# EAGLE design M2S-v2-Modular (EAGLE 9.6.2)
DESIGNER: Mark Aldritz Dela Virgen; REV: A
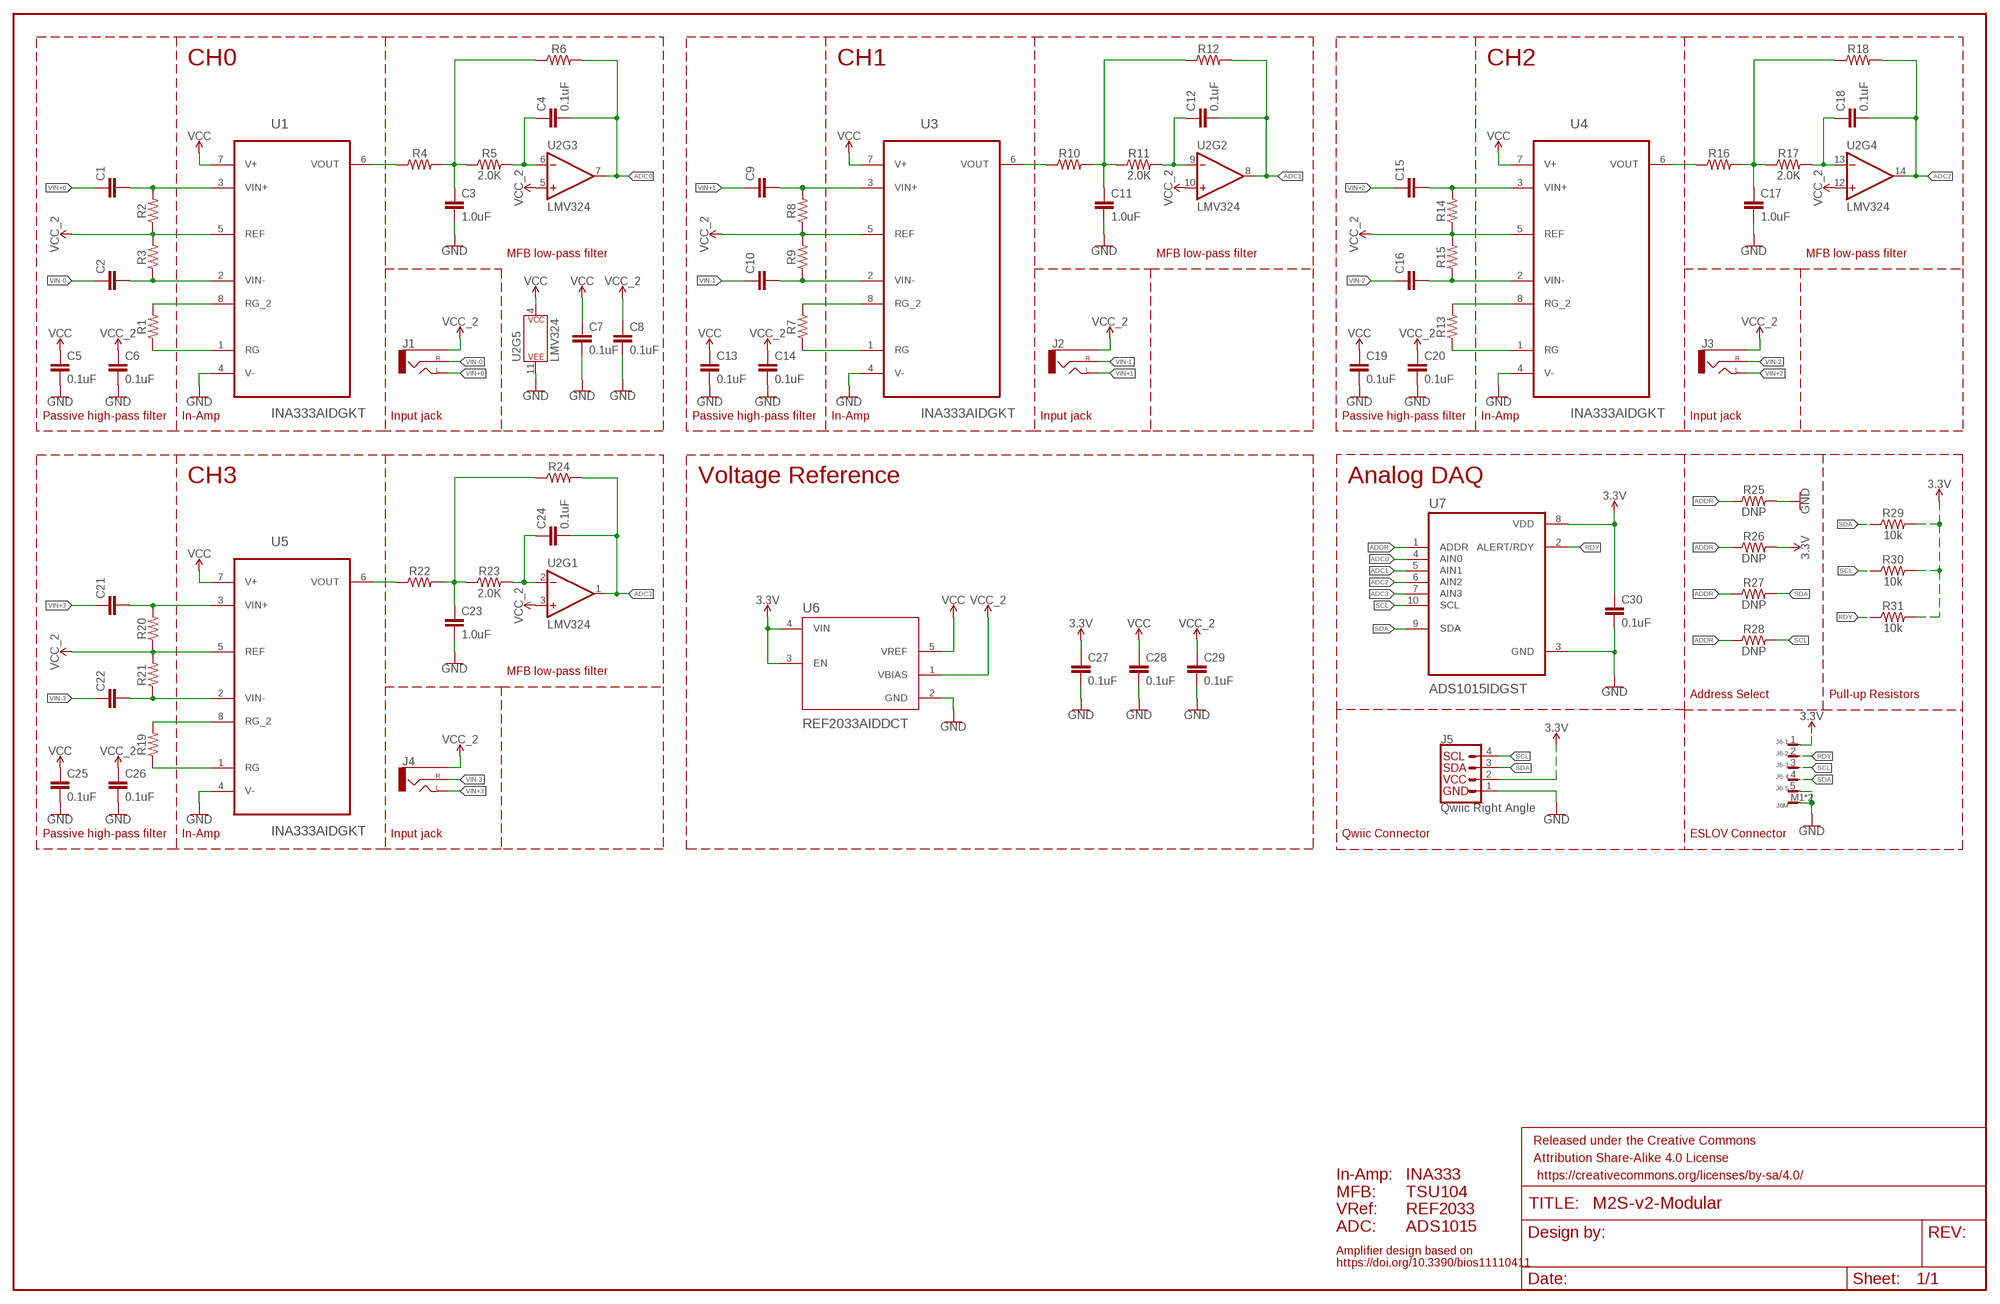
[diagram p0: schematic, sheet 1]

## Parts
C1  0.22uF  CAP-0402  [0402]
C2  0.22uF  CAP-0402  [0402]
C3  1.0uF  1.0UF-0402-16V-10%  [0402]
C4  0.1uF  0.1UF-0402-6.3V-10%-X7R  [0402]
C5  0.1uF  0.1UF-0402-6.3V-10%-X7R  [0402]
C6  0.1uF  0.1UF-0402-6.3V-10%-X7R  [0402]
C7  0.1uF  0.1UF-0402-6.3V-10%-X7R  [0402]
C8  0.1uF  0.1UF-0402-6.3V-10%-X7R  [0402]
C9  0.22uF  CAP-0402  [0402]
C10  0.22uF  CAP-0402  [0402]
C11  1.0uF  1.0UF-0402-16V-10%  [0402]
C12  0.1uF  0.1UF-0402-6.3V-10%-X7R  [0402]
C13  0.1uF  0.1UF-0402-6.3V-10%-X7R  [0402]
C14  0.1uF  0.1UF-0402-6.3V-10%-X7R  [0402]
C15  0.22uF  CAP-0402  [0402]
C16  0.22uF  CAP-0402  [0402]
C17  1.0uF  1.0UF-0402-16V-10%  [0402]
C18  0.1uF  0.1UF-0402-6.3V-10%-X7R  [0402]
C19  0.1uF  0.1UF-0402-6.3V-10%-X7R  [0402]
C20  0.1uF  0.1UF-0402-6.3V-10%-X7R  [0402]
C21  0.22uF  CAP-0402  [0402]
C22  0.22uF  CAP-0402  [0402]
C23  1.0uF  1.0UF-0402-16V-10%  [0402]
C24  0.1uF  0.1UF-0402-6.3V-10%-X7R  [0402]
C25  0.1uF  0.1UF-0402-6.3V-10%-X7R  [0402]
C26  0.1uF  0.1UF-0402-6.3V-10%-X7R  [0402]
C27  0.1uF  0.1UF-0402-6.3V-10%-X7R  [0402]
C28  0.1uF  0.1UF-0402-6.3V-10%-X7R  [0402]
C29  0.1uF  0.1UF-0402-6.3V-10%-X7R  [0402]
C30  0.1uF  0.1UF-0402-6.3V-10%-X7R  [0402]
FRAME1  FRAME-LEDGERNO_FOOTPRINT  [DUMMY]
J1  AUDIO_JACK_2.5MM_2.5MM  [STEREOJACK2.5MM_STEREOJACK2.5MM]
J2  AUDIO_JACK_2.5MM_2.5MM  [STEREOJACK2.5MM_STEREOJACK2.5MM]
J3  AUDIO_JACK_2.5MM_2.5MM  [STEREOJACK2.5MM_STEREOJACK2.5MM]
J4  AUDIO_JACK_2.5MM_2.5MM  [STEREOJACK2.5MM_STEREOJACK2.5MM]
J5  Qwiic Right Angle  I2C_STANDARDQWIIC  [JST04_1MM_RA]
J6  SM05B-SRSS-TB  [SM05B-SRSS-TB]
R1  1KOHM-0402-1/16W-1%  [0402]
R2  RESISTOR0402  [0402]
R3  RESISTOR0402  [0402]
R4  RESISTOR0402  [0402]
R5  2.0K  2.0KOHM-0402-1/16W-1%  [0402]
R6  RESISTOR0402  [0402]
R7  1KOHM-0402-1/16W-1%  [0402]
R8  RESISTOR0402  [0402]
R9  RESISTOR0402  [0402]
R10  RESISTOR0402  [0402]
R11  2.0K  2.0KOHM-0402-1/16W-1%  [0402]
R12  RESISTOR0402  [0402]
R13  1KOHM-0402-1/16W-1%  [0402]
R14  RESISTOR0402  [0402]
R15  RESISTOR0402  [0402]
R16  RESISTOR0402  [0402]
R17  2.0K  2.0KOHM-0402-1/16W-1%  [0402]
R18  RESISTOR0402  [0402]
R19  1KOHM-0402-1/16W-1%  [0402]
R20  RESISTOR0402  [0402]
R21  RESISTOR0402  [0402]
R22  RESISTOR0402  [0402]
R23  2.0K  2.0KOHM-0402-1/16W-1%  [0402]
R24  RESISTOR0402  [0402]
R25  DNP  DNP-0402  [0402]
R26  DNP  DNP-0402  [0402]
R27  DNP  DNP-0402  [0402]
R28  DNP  DNP-0402  [0402]
R29  10k  10KOHM-0402-1/16W-1%  [0402]
R30  10k  10KOHM-0402-1/16W-1%  [0402]
R31  10k  10KOHM-0402-1/16W-1%  [0402]
U1  INA333AIDGKT  [SOP65P490X110-8N]
U2  LMV324  [SO14]
U3  INA333AIDGKT  [SOP65P490X110-8N]
U4  INA333AIDGKT  [SOP65P490X110-8N]
U5  INA333AIDGKT  [SOP65P490X110-8N]
U6  REF2033AIDDCT  [SOT95P280X110-5N]
U7  ADS1015IDGST  [SOP50P490X110-10N]

## Nets
3.3V: C27.1 C30.1 J5.2 J6.1 R26.2 R29.2 R30.2 R31.2 U6.3(EN) U6.4(VIN) U7.8(VDD)
ADC0: C4.2 R6.2 U2.7(OUT) U7.4(AIN0)
ADC1: C12.2 R12.2 U2.8(OUT) U7.5(AIN1)
ADC2: C18.2 R18.2 U2.14(OUT) U7.6(AIN2)
ADC3: C24.2 R24.2 U2.1(OUT) U7.7(AIN3)
ADDR: R25.1 R26.1 R27.1 R28.1 U7.1(ADDR)
GND: C3.2 C5.2 C6.2 C7.2 C8.2 C11.2 C13.2 C14.2 C17.2 C19.2 C20.2 C23.2 C25.2 C26.2 C27.2 C28.2 C29.2 C30.2 J5.1 J6.5 J6.M1 J6.M2 R25.2 U1.4(V-) U2.11(P$V-) U3.4(V-) U4.4(V-) U5.4(V-) U6.2(GND) U7.3(GND)
N$1: R1.2 U1.8(RG_2)
N$2: R1.1 U1.1(RG)
N$3: C1.2 R2.2 U1.3(VIN+)
N$4: C2.2 R3.1 U1.2(VIN-)
N$5: R4.1 U1.6(VOUT)
N$6: C3.1 R4.2 R5.1 R6.1
N$7: C4.1 R5.2 U2.6(-IN)
N$8: R7.2 U3.8(RG_2)
N$9: R7.1 U3.1(RG)
N$10: C9.2 R8.2 U3.3(VIN+)
N$11: C10.2 R9.1 U3.2(VIN-)
N$12: R10.1 U3.6(VOUT)
N$13: C11.1 R10.2 R11.1 R12.1
N$14: C12.1 R11.2 U2.9(-IN)
N$15: R13.2 U4.8(RG_2)
N$16: R13.1 U4.1(RG)
N$17: C15.2 R14.2 U4.3(VIN+)
N$18: C16.2 R15.1 U4.2(VIN-)
N$19: R16.1 U4.6(VOUT)
N$20: C17.1 R16.2 R17.1 R18.1
N$21: C18.1 R17.2 U2.13(-IN)
N$22: R19.2 U5.8(RG_2)
N$23: R19.1 U5.1(RG)
N$24: C21.2 R20.2 U5.3(VIN+)
N$25: C22.2 R21.1 U5.2(VIN-)
N$26: R22.1 U5.6(VOUT)
N$27: C23.1 R22.2 R23.1 R24.1
N$28: C24.1 R23.2 U2.2(-IN)
RDY: J6.2 R31.1 U7.2(ALERT/RDY)
SCL: J5.4 J6.3 R28.2 R30.1 U7.10(SCL)
SDA: J5.3 J6.4 R27.2 R29.1 U7.9(SDA)
VCC: C5.1 C7.1 C13.1 C19.1 C25.1 C28.1 U1.7(V+) U2.4(P$V+) U3.7(V+) U4.7(V+) U5.7(V+) U6.5(VREF)
VCC_2: C6.1 C8.1 C14.1 C20.1 C26.1 C29.1 J1.RING1(SLEEVE) J2.RING1(SLEEVE) J3.RING1(SLEEVE) J4.RING1(SLEEVE) R2.1 R3.2 R8.1 R9.2 R14.1 R15.2 R20.1 R21.2 U1.5(REF) U2.3(+IN) U2.5(+IN) U2.10(+IN) U2.12(+IN) U3.5(REF) U4.5(REF) U5.5(REF) U6.1(VBIAS)
VIN+0: C1.1 J1.SHIELD(LEFT)
VIN+1: C9.1 J2.SHIELD(LEFT)
VIN+2: C15.1 J3.SHIELD(LEFT)
VIN+3: C21.1 J4.SHIELD(LEFT)
VIN-0: C2.1 J1.TIP(RIGHT)
VIN-1: C10.1 J2.TIP(RIGHT)
VIN-2: C16.1 J3.TIP(RIGHT)
VIN-3: C22.1 J4.TIP(RIGHT)

## Notes on the sheet
- CH0 | CH1 | CH2
- MFB low-pass filter | MFB low-pass filter | MFB low-pass filter
- Passive high-pass filter | In-Amp | Input jack | Passive high-pass filter | In-Amp | Input jack | Passive high-pass filter | In-Amp | Input jack
- CH3 | Voltage Reference | Analog DAQ
- MFB low-pass filter
- Address Select | Pull-up Resistors
- Passive high-pass filter | In-Amp | Input jack | Qwiic Connector | ESLOV Connector
- In-Amp:
  MFB:
  VRef:
  ADC:
- INA333
  TSU104
  REF2033
  ADS1015
- Amplifier design based on 
  https://doi.org/10.3390/bios11110411

## Library data of the parts
C1 C2 C9 C10 C15 C16 C21 C22 = SparkFun-Capacitors:CAP
C3 C11 C17 C23 = SparkFun-Capacitors:1.0UF: 1µF ceramic capacitors A capacitor is a passive two-terminal electrical component used to store electrical energy temporarily in an electric field.; PROD_ID: CAP-12417
C4-C8 C12-C14 C18-C20 C24-C30 = SparkFun-Capacitors:0.1UF: 0.1µF ceramic capacitors A capacitor is a passive two-terminal electrical component used to store electrical energy temporarily in an electric field.; PROD_ID: CAP-14993
FRAME1 = SparkFun-Aesthetics:FRAME-LEDGER: Schematic Frame - Ledger Standard 11x14 US Ledger frame
J1-J4 = SparkFun-Connectors:AUDIO_JACK_2.5MM: Audio Jack 2.5mm variants of PTH and SMT audio jacks. SparkFun Products: SparkFun PicoBoard <https://www.sparkfun.com/products/11888>- 2.5mm SMD; PROD_ID: CONN-09878
J5 = SparkFun-Connectors:I2C_STANDARD: SparkFun I2C Standard Pinout Header SparkFun has standardized on a pinout for all I2C based sensor breakouts. This pinout allows I2C boards to be plugged directly into the headers on Arduino Uno compatible boards, and to be daisy chained easily. Example SparkFun Products: SparkFun Atmospheric Sensor Breakout - BME280 <https://www.sparkfun.com/products/13676> SparkFun Altitude/Pressure Sensor Breakout - MPL3115A2 <https://www.sparkfun.com/products/11084> SparkFun TOF Range Finder Sensor - VL6180 <https://www.sparkfun.com/products/12785>; PROD_ID: CONN-13694
J6 = con-JST-SH:SM05B-SRSS-TB
R1 R7 R13 R19 = SparkFun-Resistors:1KOHM: 1kΩ resistor A resistor is a passive two-terminal electrical component that implements electrical resistance as a circuit element. Resistors act to reduce current flow, and, at the same time, act to lower voltage levels within circuits. - Wikipedia; PROD_ID: RES-14342
R2-R4 R6 R8-R10 R12 R14-R16 R18 R20-R22 R24 = SparkFun-Resistors:RESISTOR: Generic Resistor Package
R5 R11 R17 R23 = SparkFun-Resistors:2.0KOHM: 2kΩ resistor A resistor is a passive two-terminal electrical component that implements electrical resistance as a circuit element. Resistors act to reduce current flow, and, at the same time, act to lower voltage levels within circuits. - Wikipedia; PROD_ID: RES-15406
R25-R28 = SparkFun-Resistors:DNP: Do-Not-Populate resistor A resistor is a passive two-terminal electrical component that implements electrical resistance as a circuit element. Resistors act to reduce current flow, and, at the same time, act to lower voltage levels within circuits. - Wikipedia
R29-R31 = SparkFun-Resistors:10KOHM: 10kΩ resistor A resistor is a passive two-terminal electrical component that implements electrical resistance as a circuit element. Resistors act to reduce current flow, and, at the same time, act to lower voltage levels within circuits. - Wikipedia; PROD_ID: RES-14241
U1 U3-U5 = INA333AIDGKT:INA333AIDGKT
U2 = SparkFun-IC-Amplifiers:LMV324: IC LMV324 Quad Op Amp Jellybean quad op-amp Datasheet <http://cdn.sparkfun.com/datasheets/Sensors/Sound/LMV324.pdf> SparkFun Products SparkFun Sensor Kit <https://www.sparkfun.com/products/13754> (DEV-13754) SparkFun Inventor's Kit for Arduino 101 <https://www.sparkfun.com/products/13844> (KIT-13844) SparkFun Sound Detector <https://www.sparkfun.com/products/12642> (SEN-12642); PROD_ID: IC-08227
U6 = REF2033AIDDCT:REF2033AIDDCT: Check availability <https://pricing.snapeda.com/parts/REF2033AIDDCT/Texas%20Instruments/view-part?ref=eda>; AVAILABILITY: In Stock; CHECK_PRICES: https://www.snapeda.com/parts/REF2033AIDDCT/Texas+Instruments/view-part/?ref=eda; DESCRIPTION: 3.3-V Vref, low-drift, low-power, dual-output Vref & Vref/2 voltage reference; MF: Texas Instruments; MP: REF2033AIDDCT; PACKAGE: SOT-23-THN-5 Texas Instruments; PRICE: None; SNAPEDA_LINK: https://www.snapeda.com/parts/REF2033AIDDCT/Texas+Instruments/view-part/?ref=snap
U7 = ADS1015IDGST:ADS1015IDGST: Check availability <https://pricing.snapeda.com/parts/ADS1015IDGST/Texas%20Instruments/view-part?ref=eda>; AVAILABILITY: In Stock; CHECK_PRICES: https://www.snapeda.com/parts/ADS1015IDGST/Texas+Instruments/view-part/?ref=eda; DESCRIPTION: 12-bit, 3.3-kSPS, 4-channel, delta-sigma ADC with PGA, oscillator, VREF, comparator and I2C; MF: Texas Instruments; MP: ADS1015IDGST; PACKAGE: VSSOP-10 Texas Instruments; PRICE: None; SNAPEDA_LINK: https://www.snapeda.com/parts/ADS1015IDGST/Texas+Instruments/view-part/?ref=snap

## Board
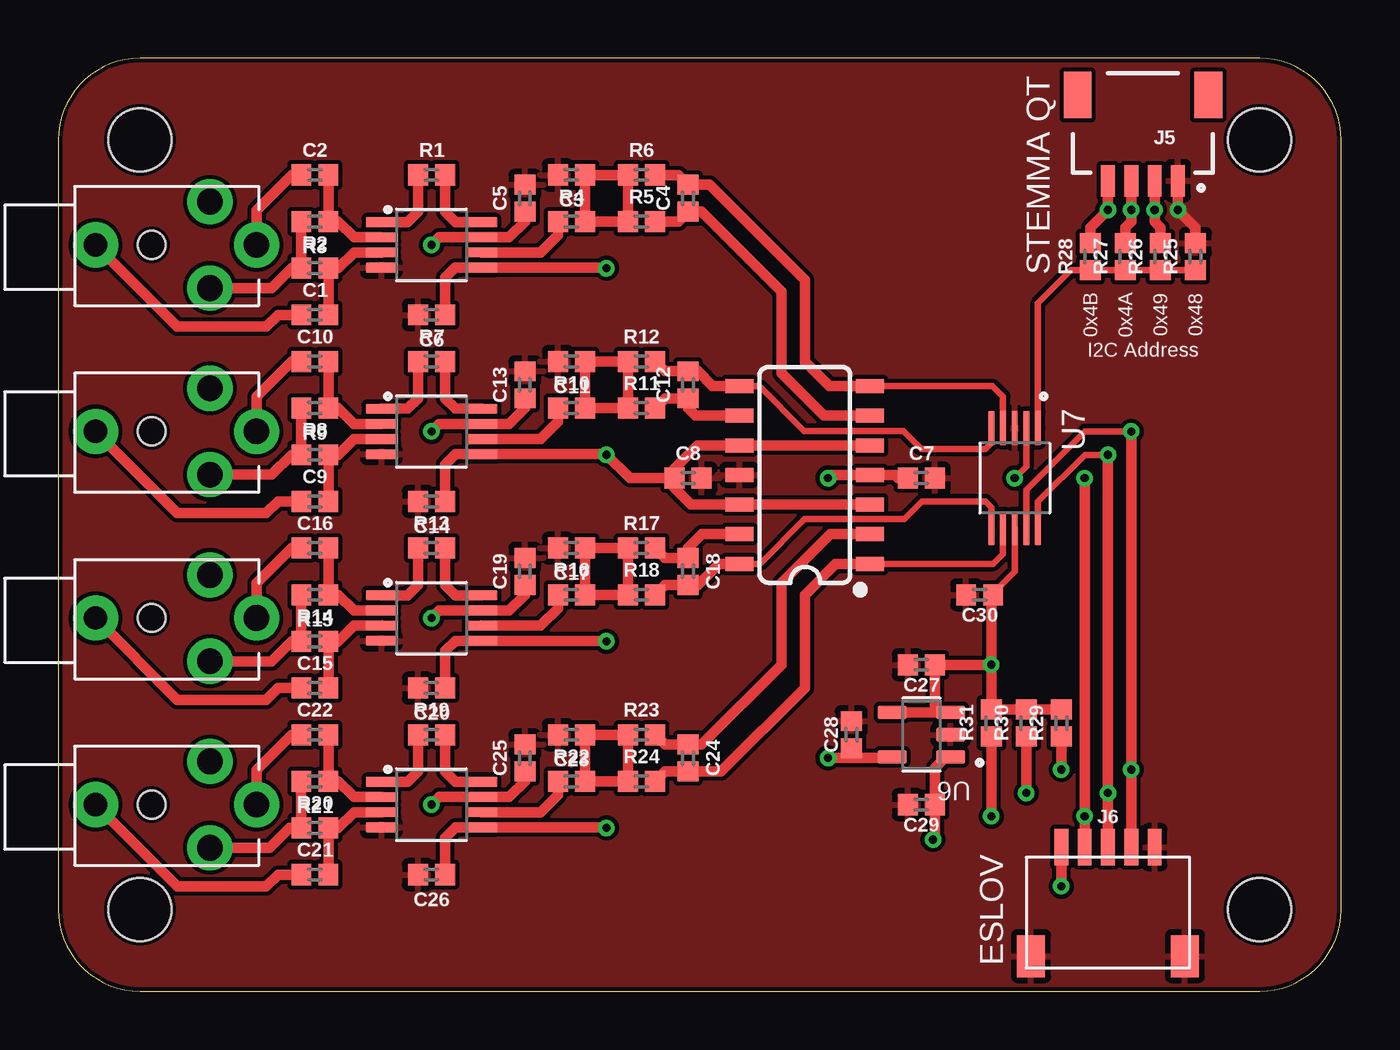
[diagram p1: board, top side]
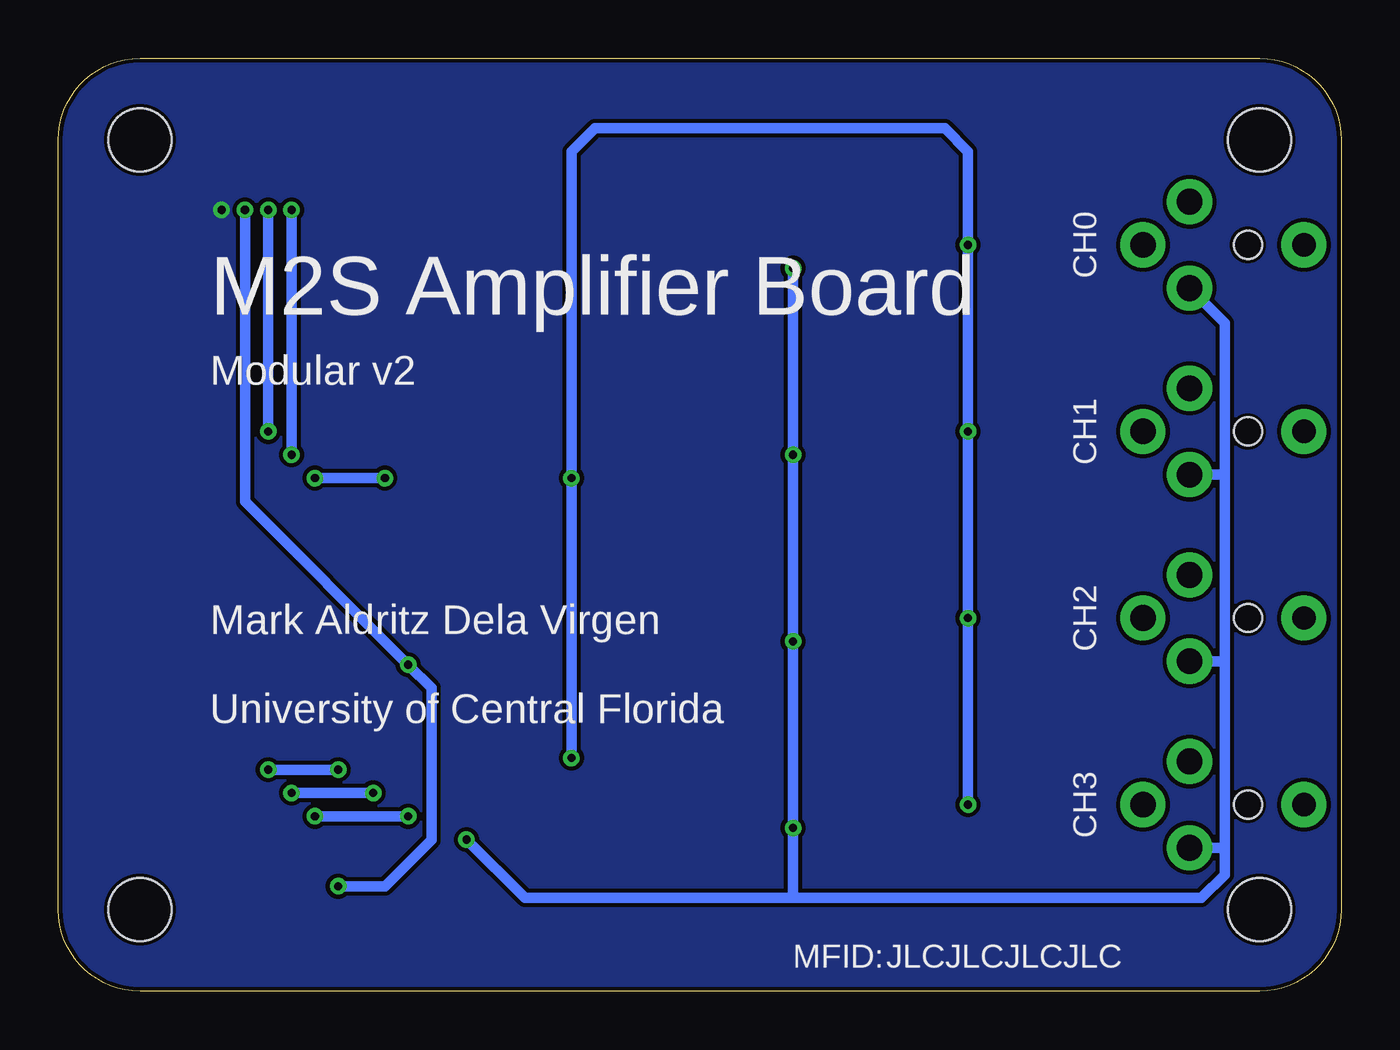
[diagram p2: board, bottom side, seen from below]

Size 55 x 40 mm. Coordinates in mm from the lower left corner, seen from the top.
Outline: 51.5,40 3.5,40 arc90 0,36.5 0,3.5 arc90 3.5,0 51.5,0 arc90 55,3.5 55,36.5 arc90 51.5,40
Copper layers (1*16): Top 0.035mm / dielectric 1.5mm / Bottom 0.035mm
Design rules "SparkFun-2-Layer-General-JLCPCB": minimum track width 7mil, minimum drill 0.3mm, track to track 7mil, track to pad 7mil, pad to pad 7mil, via to via 7mil, smd to smd 7mil, copper to edge 7mil, drill to drill 7mil, minimum pad ring 7mil, minimum via ring 7mil, stop-mask expansion 3mil, vias tented up to drill 25mil, thermal gap 10mil
Holes 2.7 mm at 3.5,3.5 51.5,3.5 51.5,36.5 3.5,36.5

### Footprints (pad centres in the part's own frame; a part is rotated, then mirrored left to right if it is on the bottom)
0402 = smd 0.85 x 0.9: 1 -0.58,0; 2 0.58,0
STEREOJACK2.5MM_STEREOJACK2.5MM = drill 1.1 pad 1.93: RING1 2.5,-1.85; RING2 2.5,1.85; TIP 4.5,0 | drill 1 pad 1.93: SHIELD -2.4,0 | hole 1.2: 0,0
JST04_1MM_RA = smd 0.6 x 1.35: 1 -1.5,0; 2 -0.5,0; 3 0.5,0; 4 1.5,0 | smd 1.2 x 2: NC1 2.8,-3.675; NC2 -2.8,-3.675
SM05B-SRSS-TB = smd 0.6 x 1.55: 1 -2,4.675; 2 -1,4.675; 3 0,4.675; 4 1,4.675; 5 2,4.675 | smd 1.2 x 1.8: M1 3.3,0; M2 -3.3,0
SOP65P490X110-8N = smd 1.34 x 0.44: 1 -2.15,0.975; 2 -2.15,0.325; 3 -2.15,-0.325; 4 -2.15,-0.975; 5 2.15,-0.975; 6 2.15,-0.325; 7 2.15,0.325; 8 2.15,0.975
SO14 = smd 0.6 x 1.2: 1 -3.175,-2.8; 2 -1.905,-2.8; 3 -0.635,-2.8; 4 0.635,-2.8; 5 1.905,-2.8; 6 3.175,-2.8; 7 4.445,-2.8; 8 4.445,2.8; 9 3.175,2.8; 10 1.905,2.8; 11 0.635,2.8; 12 -0.635,2.8; 13 -1.905,2.8; 14 -3.175,2.8
SOT95P280X110-5N = smd 1.25 x 0.59: 1 -1.255,0.95; 2 -1.255,0; 3 -1.255,-0.95; 4 1.255,-0.95; 5 1.255,0.95
SOP50P490X110-10N = smd 1.47 x 0.28: 1 -2.15,1; 2 -2.15,0.5; 3 -2.15,0; 4 -2.15,-0.5; 5 -2.15,-1; 6 2.15,-1; 7 2.15,-0.5; 8 2.15,0; 9 2.15,0.5; 10 2.15,1

### Placement (x,y rotation side)
C1  11,29 0 top
C2  11,35 0 top
C3  22,35 180 top
C4  27,34 90 top
C5  20,34 90 top
C6  16,29 180 top
C7  37,22 0 top
C8  27,22 0 top
C9  11,21 0 top
C10  11,27 0 top
C11  22,27 180 top
C12  27,26 90 top
C13  20,26 90 top
C14  16,21 180 top
C15  11,13 0 top
C16  11,19 0 top
C17  22,19 180 top
C18  27,18 270 top
C19  20,18 90 top
C20  16,13 180 top
C21  11,5 0 top
C22  11,11 0 top
C23  22,11 180 top
C24  27,10 270 top
C25  20,10 90 top
C26  16,5 180 top
C27  37,14 180 top
C28  34,11 90 top
C29  37,8 180 top
C30  39.5,17 180 top
FRAME1  0,0 0 top
J1  4,32 0 top
J2  4,24 0 top
J3  4,16 0 top
J4  4,8 0 top
J5  46.5,34.75 180 top
J6  45,1.5 0 top
R1  16,35 0 top
R2  11,31 0 top
R3  11,33 180 top
R4  22,33 0 top
R5  25,33 0 top
R6  25,35 0 top
R7  16,27 0 top
R8  11,23 0 top
R9  11,25 180 top
R10  22,25 0 top
R11  25,25 0 top
R12  25,27 0 top
R13  16,19 0 top
R14  11,15 0 top
R15  11,17 180 top
R16  22,17 0 top
R17  25,19 0 top
R18  25,17 0 top
R19  16,11 0 top
R20  11,7 0 top
R21  11,9 180 top
R22  22,9 0 top
R23  25,11 0 top
R24  25,9 0 top
R25  48.75,31.5 90 top
R26  47.25,31.5 90 top
R27  45.75,31.5 90 top
R28  44.25,31.5 90 top
R29  43,11.5 90 top
R30  41.5,11.5 90 top
R31  40,11.5 90 top
U1  16,32 0 top
U2  32,21.5 90 top
U3  16,24 0 top
U4  16,16 0 top
U5  16,8 0 top
U6  37,11 180 top
U7  41,22 270 top

### Tracks (layer width: path | path; a pad name or v marks a point on that pad's centre or on a via)
3.3V  (via drill 0.35)
  Top 0.28: C30.1 40,17 41,18 U7.8
  Top 0.44: 37.58,11.95 U6.3 | 37.58,11.95 C27.1 v40,14 | U6.4 37.58,11.95 | R26.2 47.25,32.75 47,33 v47,33.5 J5.2 | 40,17 v40,14 | v40,14 R31.2 R30.2 R29.2 | J6.1 v43,4.5
  Bottom 0.44: v47,33.5 47,21 v40,14 39,13 39,6.5 41,4.5 v43,4.5
ADC0
  Top 0.28: U2.7 40.05,25.95 40.5,25.5 U7.4
  Top 0.44: R6.2 26.58,35 C4.2 27.92,34.58 32,30.5 32,27 33.05,25.95 U2.7
ADC1
  Top 0.28: U2.8 30.05,25.95 31.98,24.02 36.23,24.02 37,23.25 39.75,23.25 40,23.5 U7.5
  Top 0.44: R12.2 26,26.58 C12.2 27.42,26.58 28.05,25.95 U2.8
ADC2
  Top 0.28: U2.14 30.07,18.32 32,20.25 36.28,20.25 37.03,21 39.75,21 40,20.75 U7.6
  Top 0.44: R18.2 26,17.42 C18.2 27.42,17.42 28.32,18.32 U2.14
ADC3
  Top 0.28: U2.1 40.08,18.32 40.5,18.75 U7.7
  Top 0.44: R24.2 26,9.42 C24.2 28.42,9.42 32,13 32,17 33.33,18.32 U2.1
ADDR
  Top 0.28: R25.1 R26.1 R27.1 R28.1 43.42,30.92 42,29.5 U7.1
GND  (via drill 0.35)
  Top 0.44: R25.2 48.75,32.75 v48,33.5 J5.1
  pour Top: -1,-1 57,-1 57,42 -1,42
  pour Bottom: -2,-2 56,-2 56,41 -2,41
N$1
  Top 0.44: U1.8 17.02,32.98 16.58,33.42 R1.2
N$2
  Top 0.44: U1.1 14.97,32.98 15.42,33.42 R1.1
N$3
  Top 0.44: C1.2 R2.2 12,31 12.68,31.68 U1.3
N$4
  Top 0.44: C2.2 R3.1 12,33 12.68,32.33 U1.2
N$5
  Top 0.44: U1.6 20.68,31.68 21.42,32.42 R4.1
N$6
  Top 0.44: R4.2 C3.1 R6.1 R5.1 R4.2
N$7
  Top 0.44: R5.2 26.58,33 C4.1 27.58,33.42 31,30 31,26.5 32.83,24.68 U2.6
N$8
  Top 0.44: U3.8 17.02,24.98 16.58,25.42 R7.2
N$9
  Top 0.44: U3.1 14.97,24.98 15.42,25.42 R7.1
N$10
  Top 0.44: C9.2 R8.2 12,23 12.68,23.68 U3.3
N$11
  Top 0.44: C10.2 R9.1 12,25 12.68,24.32 U3.2
N$12
  Top 0.44: U3.6 20.68,23.68 21.42,24.42 R10.1
N$13
  Top 0.44: C11.1 R12.1 R11.1 R10.2 C11.1
N$14
  Top 0.44: R11.2 26,25.42 C12.1 27,25 27.32,24.68 U2.9
N$15
  Top 0.44: U4.8 17.02,16.98 16.58,17.42 R13.2
N$16
  Top 0.44: U4.1 14.97,16.98 15.42,17.42 R13.1
N$17
  Top 0.44: C15.2 R14.2 12,15 12.68,15.68 U4.3
N$18
  Top 0.44: C16.2 R15.1 12,17 12.68,16.32 U4.2
N$19
  Top 0.44: U4.6 20.68,15.68 21.42,16.42 R16.1
N$20
  Top 0.44: C17.1 R17.1 R18.1 R16.2 C17.1
N$21
  Top 0.44: R17.2 26,18.58 C18.1 27,19 27.59,19.59 U2.13
N$22
  Top 0.44: U5.8 17.02,8.97 16.58,9.42 R19.2
N$23
  Top 0.44: U5.1 14.97,8.97 15.42,9.42 R19.1
N$24
  Top 0.44: C21.2 R20.2 12,7 12.68,7.67 U5.3
N$25
  Top 0.44: C22.2 R21.1 12,9 12.68,8.32 U5.2
N$26
  Top 0.44: U5.6 20.68,7.67 21.42,8.42 R22.1
N$27
  Top 0.44: C23.1 R23.1 R24.1 R22.2 C23.1
N$28
  Top 0.44: R23.2 26,10.58 C24.1 27.58,10.58 31,14 31,17.5 33.09,19.59 U2.2
RDY  (via drill 0.35)
  Top 0.28: v41,22 41.5,22.5 U7.2
  Top 0.44: v40,7.5 R31.1 | v44,22 v44,7.5 J6.2
  Bottom 0.44: v41,22 v44,22 | v44,7.5 v40,7.5
SCL  (via drill 0.35)
  Top 0.28: v45,23 44,23 42,21 U7.10
  Top 0.44: R28.2 44.25,32.75 v45,33.5 J5.4 | v41.5,8.5 R30.1 | J6.3 v45,8.5 v45,23
  Bottom 0.44: v45,33.5 v45,23 | v45,8.5 v41.5,8.5
SDA  (via drill 0.35)
  Top 0.28: v46,24 44,24 41.5,21.5 U7.9
  Top 0.44: R27.2 45.75,32.75 46,33 v46,33.5 J5.3 | R29.1 v43,9.5 | v46,24 v46,9.5 J6.4
  Bottom 0.44: v46,33.5 v46,24 | v43,9.5 v46,9.5
VCC  (via drill 0.35)
  Top 0.44: C5.1 20,33 19.32,32.33 U1.7 16.32,32.33 v16,32 | C13.1 20,25 19.32,24.32 U3.7 16.32,24.32 v16,24 | C19.1 20,17 19.32,16.32 U4.7 16.32,16.32 v16,16 | C25.1 20,9 19.32,8.32 U5.7 16.32,8.32 v16,8 | C7.1 36,22 35.87,22.14 U2.4 33.13,22.14 v33,22 | C28.1 34,10 | 34,10 35.7,10 U6.5 | 34,10 v33,10
  Bottom 0.44: v33,10 v33,22 33,36 32,37 17,37 16,36 v16,32 v16,24 v16,16 v16,8
VCC_2  (via drill 0.35)
  Top 0.44: J4.RING1 9.07,6.15 9.92,7 R20.1 R21.2 | J3.RING1 9.15,14.15 10,15 R14.1 R15.2 | J2.RING1 9.15,22.15 10,23 R8.1 R9.2 | J1.RING1 9.15,30.15 10,31 R2.1 R3.2 | C6.1 16.58,30.61 17,31.02 U1.5 23.48,31.02 v23.5,31 | C14.1 16.58,22.58 17.02,23.02 U3.5 23.48,23.02 v23.5,23 24.5,22 C8.1 | C20.1 16.58,14.58 17.02,15.03 U4.5 23.48,15.03 v23.5,15 | C26.1 16.58,6.58 17.02,7.03 U5.5 23.48,7.03 v23.5,7 | C8.1 26.42,22.42 27.41,23.41 U2.10 U2.5 | C8.1 26.42,21.58 27.14,20.86 U2.12 U2.3 | U6.1 38.05,10.05 37.58,9.58 C29.1 37.58,6.58 v37.5,6.5
  Bottom 0.44: v37.5,6.5 35,4 23.5,4 | 23.5,4 6,4 5,5 5,6.15 | J1.RING1 5,28.65 5,22.15 | J2.RING1 5,22.15 | J3.RING1 5,14.15 | J4.RING1 5,6.15 | 5,22.15 5,14.15 | 5,14.15 5,6.15 | 23.5,4 v23.5,7 v23.5,15 v23.5,23 v23.5,31
VIN+0
  Top 0.44: J1.SHIELD 5.1,28.5 8.92,28.5 9.42,29 C1.1
VIN+1
  Top 0.44: J2.SHIELD 5.1,20.5 8.92,20.5 9.42,21 C9.1
VIN+2
  Top 0.44: J3.SHIELD 5.1,12.5 8.92,12.5 9.42,13 C15.1
VIN+3
  Top 0.44: J4.SHIELD 5.1,4.5 8.92,4.5 9.42,5 C21.1
VIN-0
  Top 0.44: J1.TIP 8.5,33.5 10,35 C2.1
VIN-1
  Top 0.44: J2.TIP 8.5,25.5 10,27 C10.1
VIN-2
  Top 0.44: J3.TIP 8.5,17.5 10,19 C16.1
VIN-3
  Top 0.44: J4.TIP 8.5,9.5 10,11 C22.1

### Text on the board
tPlace: STEMMA QT | 0x4B | 0x4A | 0x49 | 0x48 | I2C Address | ESLOV
bPlace: CH0 | M2S Amplifier Board | Modular v2 | CH1 | CH2 | Mark Aldritz Dela Virgen / / University of Central Florida | CH3 | JLCJLCJLCJLC | MFID: